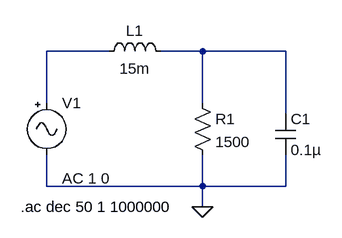
[diagram p0: schematic P1a.asc]
P1a.asc, the LTspice schematic file:
Version 4.1
SHEET 1 880 680
WIRE 144 96 48 96
WIRE 288 96 224 96
WIRE 416 96 288 96
WIRE 48 176 48 96
WIRE 288 176 288 96
WIRE 416 192 416 96
WIRE 48 304 48 256
WIRE 288 304 288 256
WIRE 288 304 48 304
WIRE 416 304 416 256
WIRE 416 304 288 304
WIRE 288 336 288 304
FLAG 288 336 0
SYMBOL Misc\\signal 48 160 R0
WINDOW 123 24 132 Left 2
WINDOW 39 0 0 Left 0
SYMATTR InstName V1
SYMATTR Value ""
SYMATTR Value2 AC 1 0
SYMBOL ind 128 112 R270
WINDOW 0 32 56 VTop 2
WINDOW 3 5 56 VBottom 2
SYMATTR InstName L1
SYMATTR Value 15m
SYMATTR SpiceLine Rser=1m
SYMBOL res 272 160 R0
SYMATTR InstName R1
SYMATTR Value 1500
SYMBOL cap 400 192 R0
SYMATTR InstName C1
SYMATTR Value 0.1µ
TEXT 8 336 Left 2 !.ac dec 50 1 1000000

The netlist it stands for:
* P1a.asc
V1 N001 0 AC 1 0
L1 N001 N002 15m Rser=1m
R1 N002 0 1500
C1 N002 0 0.1µ
.ac dec 50 1 1000000
.backanno
.end